# Altium schematic sheet РЕУН.468172.001_Драйвер лазера.SchDoc: =Name-1str
size 594 x 420 mm; SheetNumber: номер страницы; Вид изделия: Документация; Раздел: Документация; Код документа: Э3; Вид документа: Схема электрическая принципиальная; Класс документа: Конструкторский документ; Создавать изделие в PLM: Yes; DocumentCode: Э3; DocumentView: Схема электрическая принципиальная; DocumentClass: Конструкторский документ; ProductView: Документация
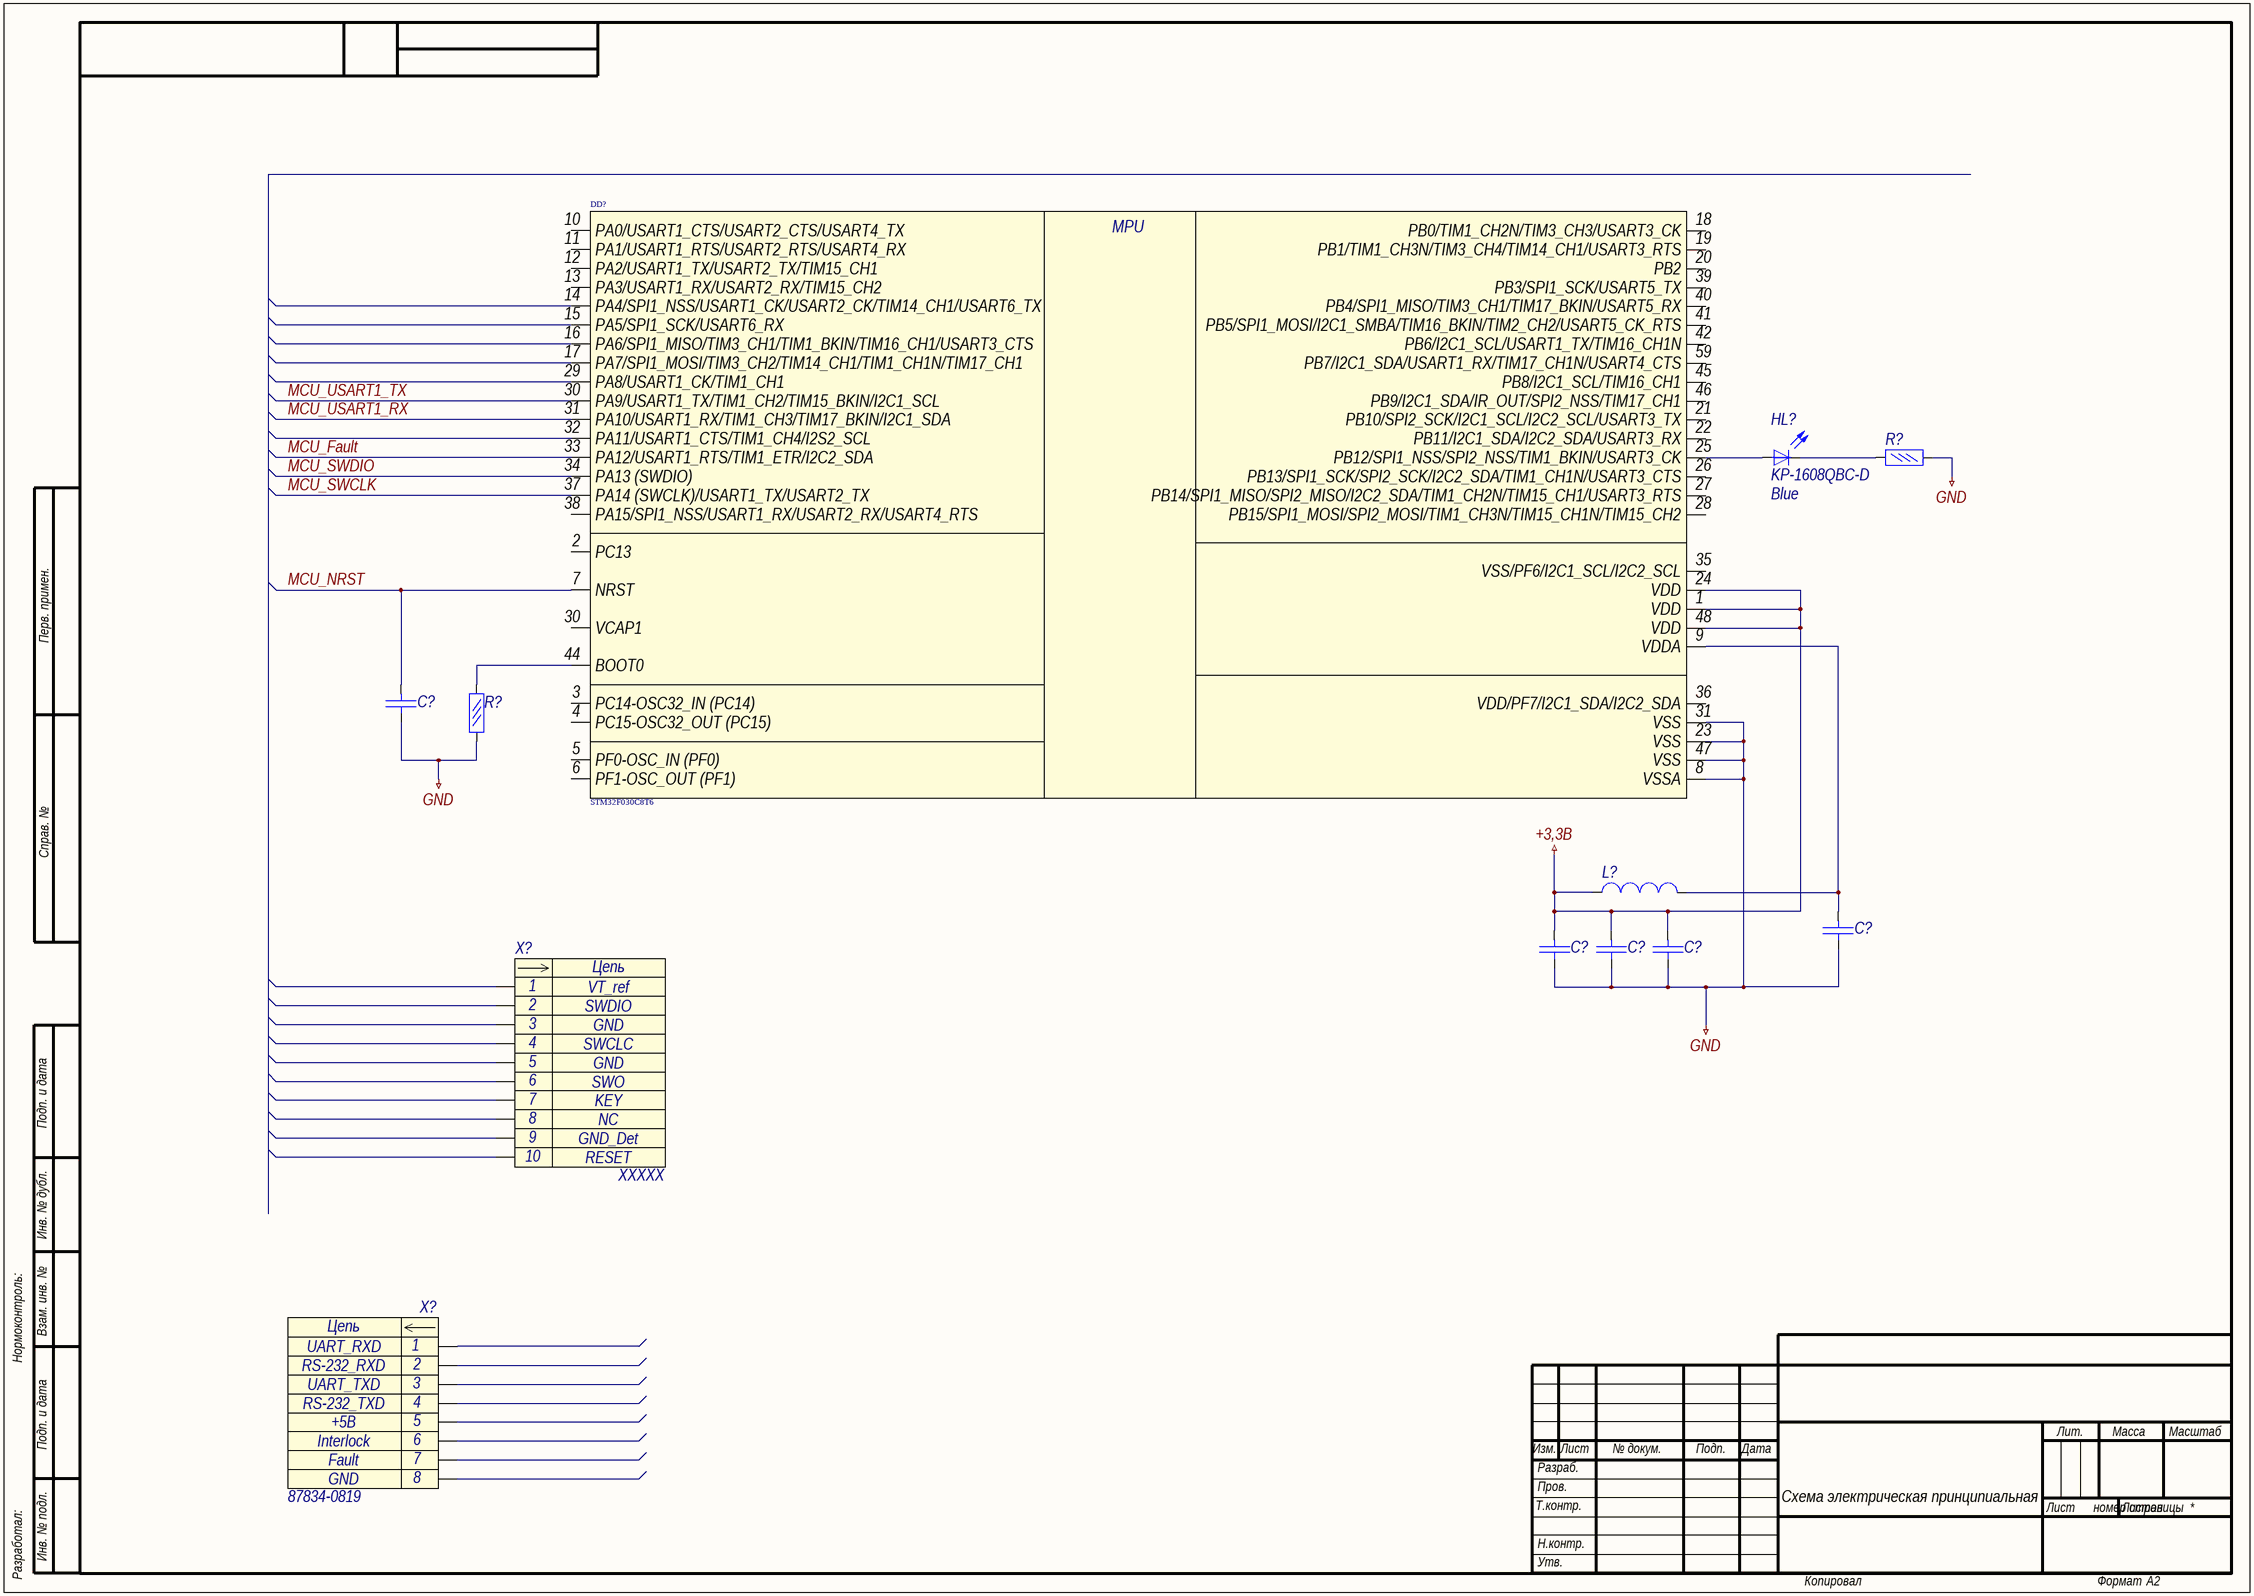
[diagram p0: РЕУН.468172.001_Драйвер лазера.SchDoc]

## Parts
(Parts that share a designator on the sheet are numbered #1, #2 ... from top to bottom, then left to right.)
C?#1  (no value)  [C0805_AA]
C?#2  (no value)  [C0805_AA]
C?#3  (no value)  [C0805_AA]
C?#4  (no value)  [C0805_AA]
C?#5  (no value)  [C0805_AA]
DD?  STM32F030C8T6
HL?  Color: Blue  (hidden comment: KP-1608QBC-D)
L?  (no value)  [L0603_A]
R?#1  (no value)  [R1206]
R?#2  (no value)  [R1206]
X?#1  XXXXX
X?#2  87834-0819

## Nets
+3,3В: C?#3.2 C?#4.2 C?#5.2 DD?.1(VDD) DD?.24(VDD) DD?.48(VDD) L?.1
GND: C?#1.1 C?#2.1 C?#3.1 C?#4.1 C?#5.1 DD?.8(VSSA) DD?.23(VSS) DD?.31(VSS) DD?.47(VSS) R?#1.2 R?#2.1
MCU_Fault: DD?.33(PA12/USART1_RTS/TIM1_ETR/I2C2_SDA)
MCU_NRST: C?#1.2 DD?.7(NRST)
MCU_SWCLK: DD?.37(PA14_(SWCLK)/USART1_TX/USART2_TX)
MCU_SWDIO: DD?.34(PA13_(SWDIO))
MCU_USART1_RX: DD?.31(PA10/USART1_RX/TIM1_CH3/TIM17_BKIN/I2C1_SDA)
MCU_USART1_TX: DD?.30(PA9/USART1_TX/TIM1_CH2/TIM15_BKIN/I2C1_SCL)
NetC?#2_2: C?#2.2 DD?.9(VDDA) L?.2
NetDD?_25: DD?.25(PB12/SPI1_NSS/SPI2_NSS/TIM1_BKIN/USART3_CK) HL?.1(A)
NetDD?_44: DD?.44(BOOT0) R?#2.2
NetHL?_2: HL?.2(K) R?#1.1

Not connected (* = marked no-connect by the designer): DD? 2(PC13) 3(PC14-OSC32_IN_(PC14)) 4(PC15-OSC32_OUT_(PC15)) 5(PF0-OSC_IN_(PF0)) 6(PF1-OSC_OUT_(PF1)) 10(PA0/USART1_CTS/USART2_CTS/USART4_TX) 11(PA1/USART1_RTS/USART2_RTS/USART4_RX) 12(PA2/USART1_TX/USART2_TX/TIM15_CH1) 13(PA3/USART1_RX/USART2_RX/TIM15_CH2) 14(PA4/SPI1_NSS/USART1_CK/USART2_CK/TIM14_CH1/USART6_TX) 15(PA5/SPI1_SCK/USART6_RX) 16(PA6/SPI1_MISO/TIM3_CH1/TIM1_BKIN/TIM16_CH1/USART3_CTS) 17(PA7/SPI1_MOSI/TIM3_CH2/TIM14_CH1/TIM1_CH1N/TIM17_CH1) 18(PB0/TIM1_CH2N/TIM3_CH3/USART3_CK) 19(PB1/TIM1_CH3N/TIM3_CH4/TIM14_CH1/USART3_RTS) 20(PB2) 21(PB10/SPI2_SCK/I2C1_SCL/I2C2_SCL/USART3_TX) 22(PB11/I2C1_SDA/I2C2_SDA/USART3_RX) 26(PB13/SPI1_SCK/SPI2_SCK/I2C2_SDA/TIM1_CH1N/USART3_CTS) 27(PB14/SPI1_MISO/SPI2_MISO/I2C2_SDA/TIM1_CH2N/TIM15_CH1/USART3_RTS) 28(PB15/SPI1_MOSI/SPI2_MOSI/TIM1_CH3N/TIM15_CH1N/TIM15_CH2) 29(PA8/USART1_CK/TIM1_CH1) 32(PA11/USART1_CTS/TIM1_CH4/I2S2_SCL) 35(VSS/PF6/I2C1_SCL/I2C2_SCL) 36(VDD/PF7/I2C1_SDA/I2C2_SDA) 38(PA15/SPI1_NSS/USART1_RX/USART2_RX/USART4_RTS) 39(PB3/SPI1_SCK/USART5_TX) 40(PB4/SPI1_MISO/TIM3_CH1/TIM17_BKIN/USART5_RX) 41(PB5/SPI1_MOSI/I2C1_SMBA/TIM16_BKIN/TIM2_CH2/USART5_CK_RTS) 42(PB6/I2C1_SCL/USART1_TX/TIM16_CH1N) 45(PB8/I2C1_SCL/TIM16_CH1) 46(PB9/I2C1_SDA/IR_OUT/SPI2_NSS/TIM17_CH1) 59(PB7/I2C1_SDA/USART1_RX/TIM17_CH1N/USART4_CTS); X?#1 1 2 3 4 5 6 7 8 9 10; X?#2 1 2 3 4 5 6 7 8

## Notes on the sheet
- Перв. примен.
- Справ. №
- Подп. и дата
- Инв. № дубл.
- Нормоконтроль:
- Взам. инв. №
- Изм.
- Лист
- № докум.
- Подп.
- Дата
- Лит.
- Масса
- Масштаб
- Т.контр.
- Пров.
- Разраб.
- Листов
- Разработал:
- Инв. № подл.
- Н.контр.
- Утв.
- Копировал
- Формат
- А2
- (in symbol STM32F030C8T6) MPU
- (in symbol x8-m) Цепь
- (in symbol x10-m) Цепь

## Library data of the parts
C?#1-C?#5 = Конденсатор кер.
DD? = STM32F030C8T6: 32-битный микроконтроллер; Name: STM32F030C8T6
HL? = led: Светодиод; Name: KP-1608QBC-D
L? = Inductor: Катушка индуктивности
R?#1 R?#2 = Резистор  0,05Вт: Резистор 0,05Вт; Power rating: 0,05Вт
X?#1 = x10-m: Разъем - 10 конт. вилка; Contact_1: VT_ref; Contact_2: SWDIO; Contact_3: GND; Contact_4: SWCLC; Contact_6: SWO; Contact_7: KEY; Contact_8: NC; Contact_9: GND_Det; Contact_10: RESET; Contact_5: GND; Name: XXXXX
X?#2 = x8-m: Разъем - 8 конт. вилка; Contact_1: UART_RXD; Contact_2: RS-232_RXD; Contact_3: UART_TXD; Contact_4: RS-232_TXD; Contact_5: +5В; Contact_6: Interlock; Contact_7: Fault; Contact_8: GND; Name: 87834-0819